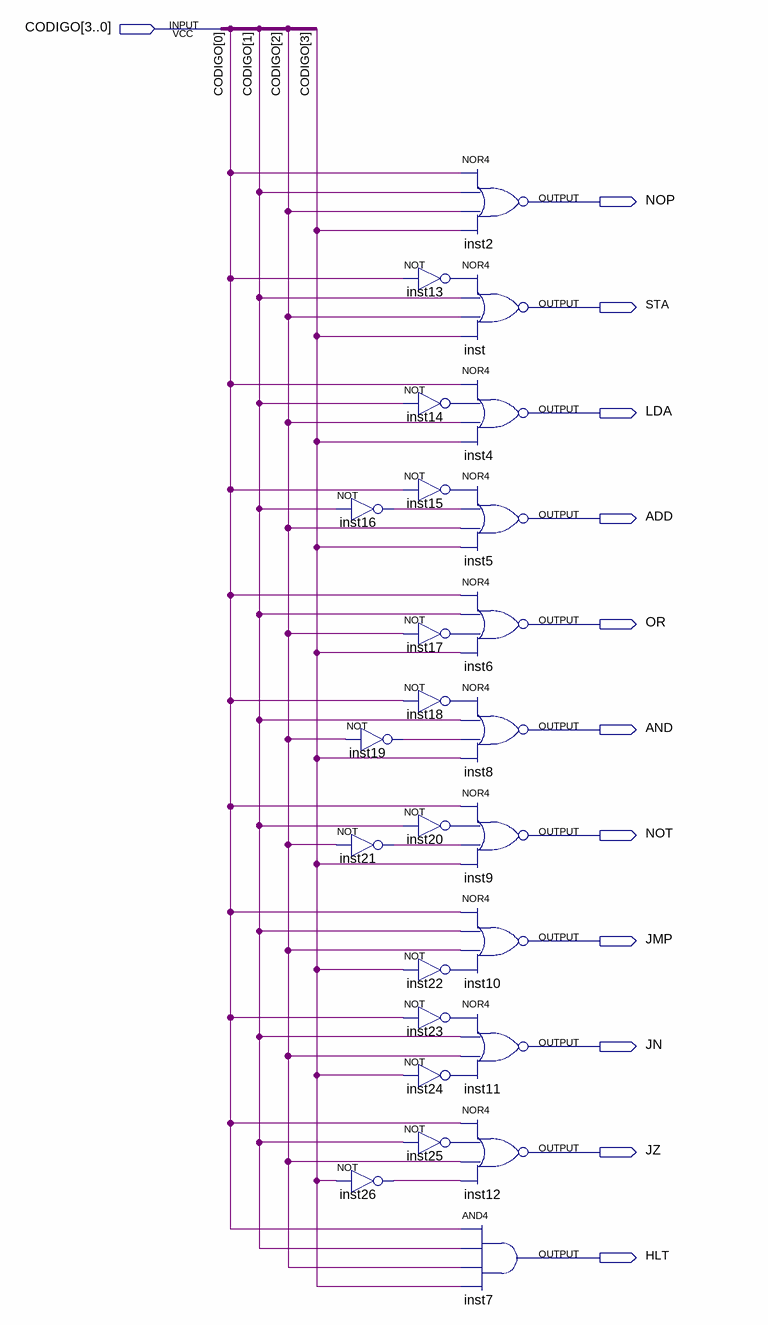
[diagram p0: schematic sheet]
// Quartus schematic decodificador_instrucoes.bdf as structural Verilog: 25 symbols, 12 pins
module decodificador_instrucoes (
  input  [3:0] CODIGO,
  output NOP,
  output STA,
  output LDA,
  output ADD,
  output OR,
  output AND,
  output NOT,
  output JMP,
  output JN,
  output JZ,
  output HLT
);

  wire inst13_out, inst14_out, inst15_out, inst16_out, inst17_out, inst18_out, inst19_out, inst20_out,
       inst21_out, inst22_out, inst23_out, inst24_out, inst25_out, inst26_out;

  not inst16 (inst16_out, CODIGO[1]);
  not inst19 (inst19_out, CODIGO[2]);
  not inst21 (inst21_out, CODIGO[2]);
  not inst26 (inst26_out, CODIGO[3]);
  not inst13 (inst13_out, CODIGO[0]);
  not inst14 (inst14_out, CODIGO[1]);
  not inst15 (inst15_out, CODIGO[0]);
  not inst17 (inst17_out, CODIGO[2]);
  not inst18 (inst18_out, CODIGO[0]);
  not inst20 (inst20_out, CODIGO[1]);
  not inst22 (inst22_out, CODIGO[3]);
  not inst23 (inst23_out, CODIGO[0]);
  not inst24 (inst24_out, CODIGO[3]);
  not inst25 (inst25_out, CODIGO[1]);
  nor inst2 (NOP, CODIGO[0], CODIGO[1], CODIGO[2], CODIGO[3]);
  nor inst (STA, inst13_out, CODIGO[1], CODIGO[2], CODIGO[3]);
  nor inst4 (LDA, CODIGO[0], inst14_out, CODIGO[2], CODIGO[3]);
  nor inst5 (ADD, inst15_out, inst16_out, CODIGO[2], CODIGO[3]);
  nor inst6 (OR, CODIGO[0], CODIGO[1], inst17_out, CODIGO[3]);
  nor inst8 (AND, inst18_out, CODIGO[1], inst19_out, CODIGO[3]);
  nor inst9 (NOT, CODIGO[0], inst20_out, inst21_out, CODIGO[3]);
  nor inst10 (JMP, CODIGO[0], CODIGO[1], CODIGO[2], inst22_out);
  nor inst11 (JN, inst23_out, CODIGO[1], CODIGO[2], inst24_out);
  nor inst12 (JZ, CODIGO[0], inst25_out, CODIGO[2], inst26_out);
  and inst7 (HLT, CODIGO[0], CODIGO[1], CODIGO[2], CODIGO[3]);
endmodule
